# Altium schematic sheet 03 - IMU.SchDoc: IMU
size A4; DrawnBy: Trevor Charmley; DocumentNumber: 5; Revision: 1; SheetNumber: 5; SheetTotal: 8
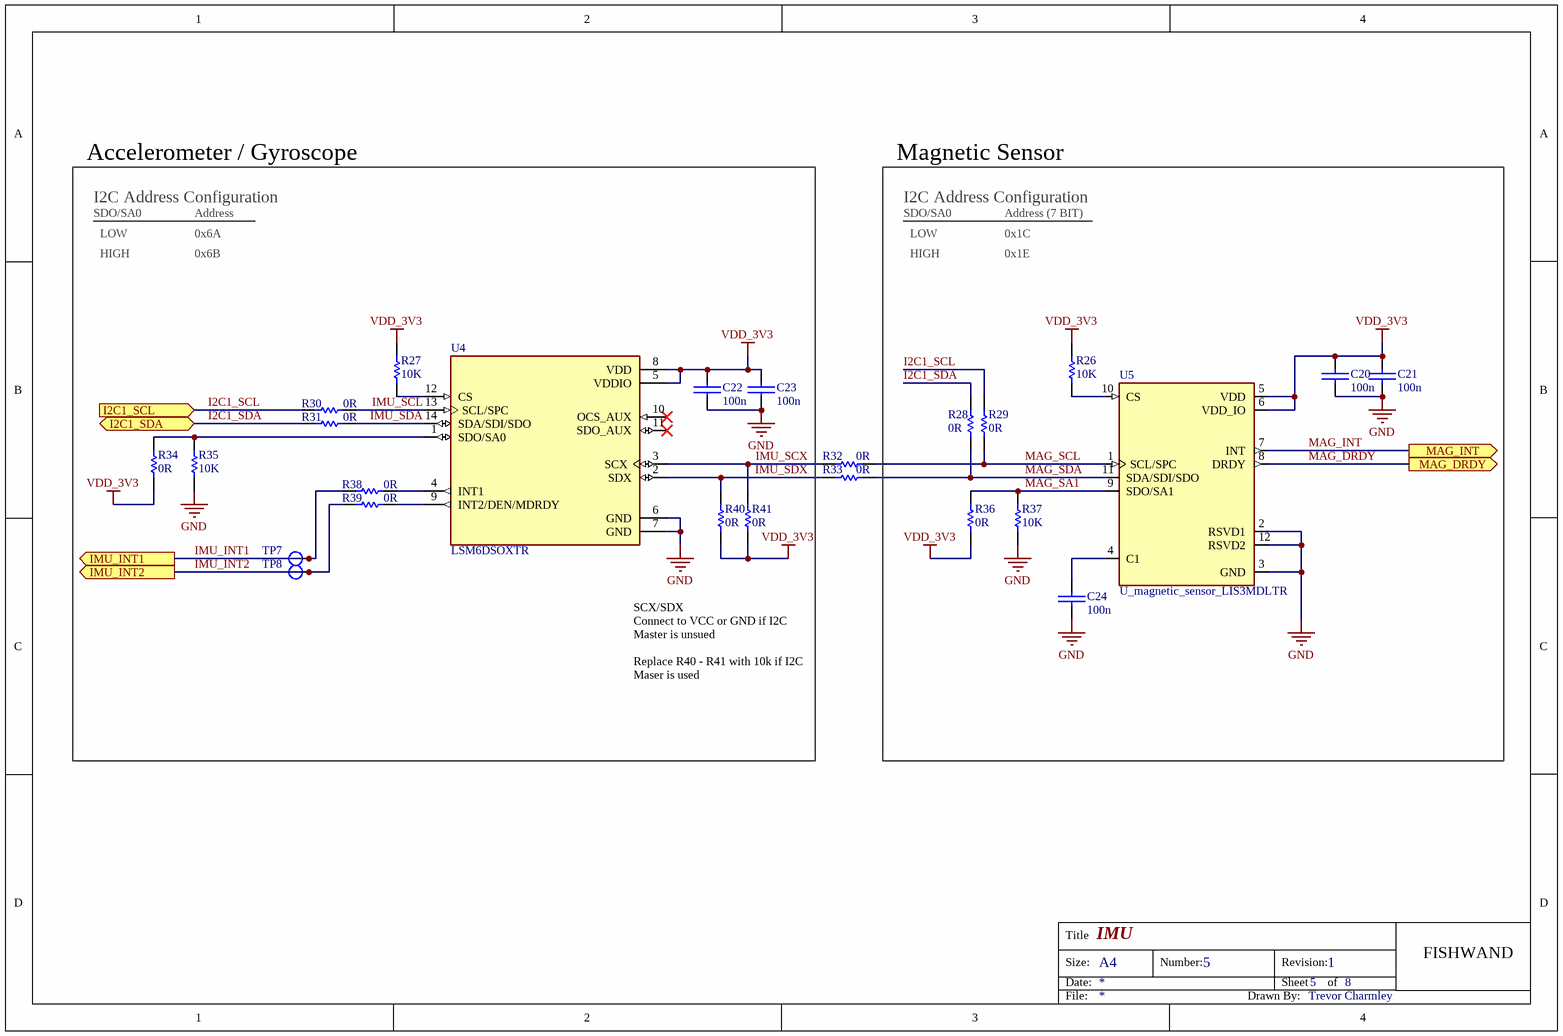
[diagram p0: 03 - IMU.SchDoc]

## Parts
C20  100n  [CAPC100X50X65]
C21  100n  [CAPC100X50X65]
C22  100n  [CAPC100X50X65]
C23  100n  [CAPC100X50X65]
C24  100n  [CAPC100X50X65]
R26  10K  [RESC0402]
R27  10K  [RESC0402]
R28  0R  [RESC0402]
R29  0R  [RESC0402]
R30  0R  [RESC0402]
R31  0R  [RESC0402]
R32  0R  [RESC0402]
R33  0R  [RESC0402]
R34  0R  [RESC0402]
R35  10K  [RESC0402]
R36  0R  [RESC0402]
R37  10K  [RESC0402]
R38  0R  [RESC0402]
R39  0R  [RESC0402]
R40  0R  [RESC0402]
R41  0R  [RESC0402]
TP7  Test Point  [tp_1mm]  (value not drawn)  (no BOM)
TP8  Test Point  [tp_1mm]  (value not drawn)  (no BOM)
U4  LSM6DSOXTR  [PQFN50P300X250X86-14N]
U5  U_magnetic_sensor_LIS3MDLTR  [XDCR_LIS3MDLTR]

## Blocks framed on the sheet
Accelerometer / Gyroscope: C22 C23 R27 R30 R31 R34 R35 R38-R41 TP7 TP8 U4
Magnetic Sensor: C20 C21 C24 R26 R28 R29 R36 R37 U5

## Ports
I2C1_SCL (in), I2C1_SDA (bidir), IMU_INT1 (out), IMU_INT2 (out), MAG_DRDY (out), MAG_INT (out)

## Nets
GND: C20.2 C21.2 C22.2 C23.2 C24.2 R35.1 R37.1 U4.6(GND) U4.7(GND) U5.2(RSVD1) U5.3(GND) U5.12(RSVD2)
VDD_3V3: C20.1 C21.1 C22.1 C23.1 R26.2 R27.2 R34.1 R36.1 R40.1 R41.1 U4.5(VDDIO) U4.8(VDD) U5.5(VDD) U5.6(VDD_IO)
I2C1_SCL: R29.1 R30.1 ; port I2C1_SCL
I2C1_SDA: R28.1 R31.1 ; port I2C1_SDA
IMU_INT1: R38.1 TP7.1 ; port IMU_INT1
IMU_INT2: R39.1 TP8.1 ; port IMU_INT2
IMU_SCL: R30.2 U4.13(SCL/SPC)
IMU_SCX: R32.2 R41.2 U4.3(SCX)
IMU_SDA: R31.2 U4.14(SDA/SDI/SDO)
IMU_SDX: R33.2 R40.2 U4.2(SDX)
MAG_DRDY: U5.8(DRDY) ; port MAG_DRDY
MAG_INT: U5.7(INT) ; port MAG_INT
MAG_SA1: R36.2 R37.2 U5.9(SDO/SA1)
MAG_SCL: R29.2 R32.1 U5.1(SCL/SPC)
MAG_SDA: R28.2 R33.1 U5.11(SDA/SDI/SDO)
NetC24_1: C24.1 U5.4(C1)
NetR26_1: R26.1 U5.10(CS)
NetR27_1: R27.1 U4.12(CS)
NetR34_2: R34.2 R35.2 U4.1(SDO/SA0)
NetR38_2: R38.2 U4.4(INT1)
NetR39_2: R39.2 U4.9(INT2/DEN/MDRDY)

Not connected (* = marked no-connect by the designer): U4 10(OCS_AUX)* 11(SDO_AUX)*

## Notes on the sheet
- I2C Address Configuration
- SDO/SA0
- LOW
- 0x6A
- Address
- 0x1C
- Address (7 BIT)
- HIGH
- 0x6B
- 0x1E
- SCX/SDX
  Connect to VCC or GND if I2C Master is unsued
  Replace R40 - R41 with 10k if I2C Maser is used
- Title
- Size:
- Date:
- A4
- Number:
- Revision:
- Sheet
- of
- FISHWAND
- File:
- Drawn By:

## Library data of the parts
C20-C24 = C_100NF_25V_X5R_0402: CAP CER 100nF 25V X5R 0402; Manufacturer: Murata Electronics; Manufacturer PN: GRM155R61E104KA87D; Supplier: Digi-Key; Supplier PN: 490-5920-2-ND
R26 R27 R35 R37 = R_0402_10K_1%: 10 kOhms ±1% 0.063W, 1/16W Chip Resistor 0402 (1005 Metric) Moisture Resistant Thick Film; Manufacturer: YAGEO; Manufacturer PN: RC0402FR-0710KL; Supplier: *; Supplier PN: *; Value: 10K; Tolerance: 1%; Package / Case: 0402
R28-R34 R36 R38-R41 = R_0402_0R_5%: 0 Ohms Jumper 0.063W, 1/16W Chip Resistor 0402 (1005 Metric) Thick Film; Manufacturer: YAGEO; Manufacturer PN: RC0402JR-070RP; Tolerance: 5%; Supplier: *; Supplier PN: *; Value: 0R; Package / Case: 0402
TP7 TP8 = TP_1mm
U4 = U_LSM6DSOXTR: Accelerometer, Gyroscope, Temperature, 6 Axis Sensor IÂ²C, SPI Output; Manufacturer: STMicroelectronics; Value: *; Availability: Unavailable; SnapEDA_Link: https://www.snapeda.com/parts/LSM6DSMTR/STMicroelectronics/view-part/581716/?ref=snap; Package / Case: 14-VFLGA Module; Manufacturer PN: LSM6DSOXTR; Price: None; Supplier: Digi-Key; Supplier PN: 497-18367-2-ND
U5 = U_magnetic_sensor_LIS3MDLTR: Magnetoresistive Sensor X, Y, Z Axis 12-LGA _2x2_; Manufacturer: STMicroelectronics; Availability: Unavailable; Price: None; SnapEDA_Link: https://www.snapeda.com/parts/LIS3MDLTR/STMicroelectronics/view-part/382740/?ref=snap; Package / Case: VFLGA-12 STMicroelectronics; Value: *; Manufacturer PN: LIS3MDLTR; Supplier: Digi-Key; Supplier PN: 497-13892-1-ND